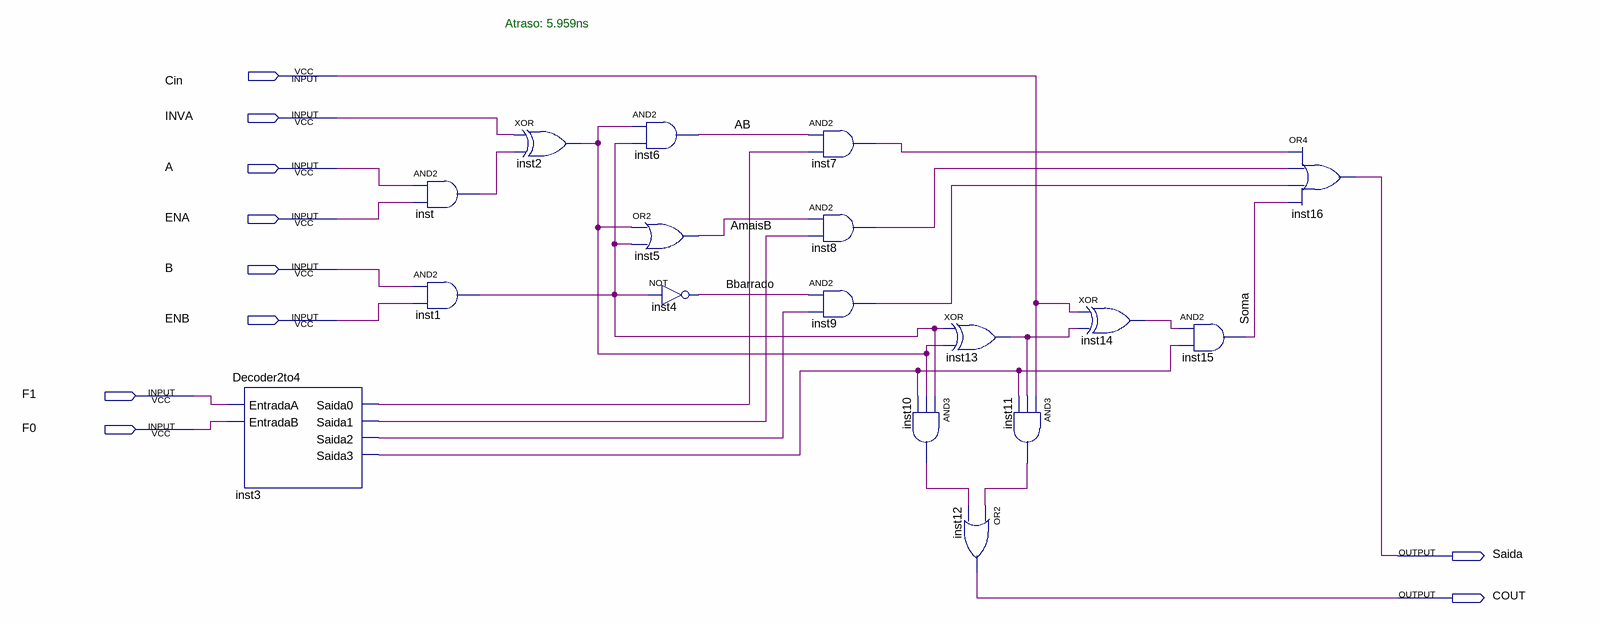
[diagram p0: schematic sheet]
// Quartus schematic ULA_1bit.bdf as structural Verilog: 17 symbols, 10 pins
module ULA_1bit (
  input  Cin,
  input  INVA,
  input  A,
  input  ENA,
  input  B,
  input  ENB,
  input  F1,
  input  F0,
  output Saida,
  output COUT
);

  wire AB, AmaisB, Bbarrado, inst1_out, inst2_out, inst3_saida0, inst3_saida1, inst3_saida2, inst3_saida3,
       inst7_out, inst8_out, inst9_out, inst10_out, inst11_out, inst13_out, inst14_out, inst_out, Soma;

  Decoder2to4 inst3 (
    .EntradaA(F1), .EntradaB(F0), .Saida0(inst3_saida0), .Saida1(inst3_saida1), .Saida2(inst3_saida2),
    .Saida3(inst3_saida3));
  and inst (inst_out, A, ENA);
  and inst1 (inst1_out, B, ENB);
  xor inst2 (inst2_out, INVA, inst_out);
  and inst6 (AB, inst2_out, inst1_out);
  or inst5 (AmaisB, inst2_out, inst1_out);
  not inst4 (Bbarrado, inst1_out);
  and inst7 (inst7_out, AB, inst3_saida0);
  and inst8 (inst8_out, AmaisB, inst3_saida1);
  and inst9 (inst9_out, Bbarrado, inst3_saida2);
  xor inst13 (inst13_out, inst1_out, inst2_out);
  and inst10 (inst10_out, inst1_out, inst2_out, inst3_saida3);
  or inst12 (COUT, inst11_out, inst10_out);
  and inst11 (inst11_out, Cin, inst13_out, inst3_saida3);
  xor inst14 (inst14_out, Cin, inst13_out);
  and inst15 (Soma, inst14_out, inst3_saida3);
  or inst16 (Saida, inst7_out, inst8_out, inst9_out, Soma);

  // Notes on the sheet:
  //   Atraso: 5.959ns
endmodule
